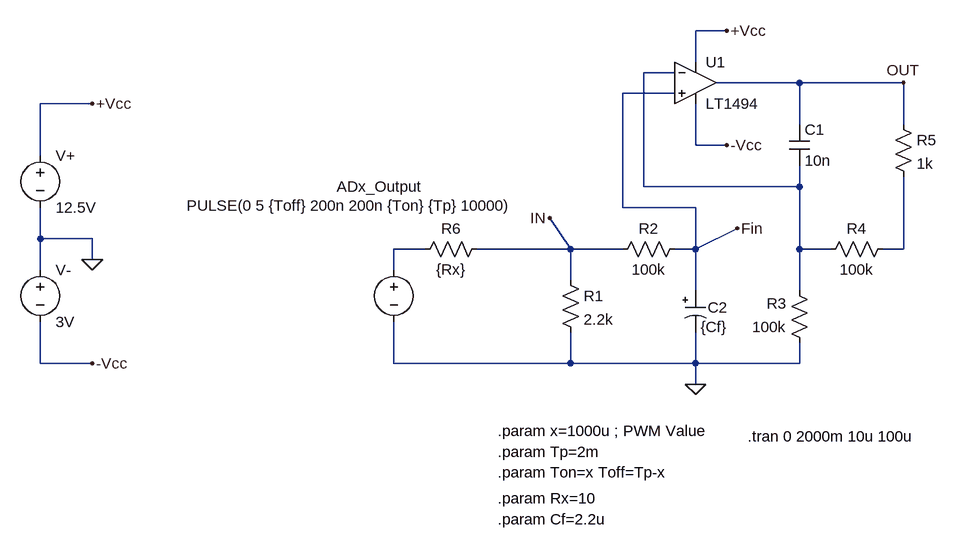
[diagram p0: schematic DAC_SIM10.asc]
DAC_SIM10.asc, the LTspice schematic file:
Version 4
SHEET 1 1124 680
WIRE 720 -304 672 -304
WIRE 672 -256 672 -304
WIRE 640 -240 592 -240
WIRE 832 -224 704 -224
WIRE 992 -224 832 -224
WIRE 640 -208 560 -208
WIRE -256 -192 -336 -192
WIRE 832 -160 832 -224
WIRE 992 -160 992 -224
WIRE 672 -128 672 -192
WIRE 720 -128 672 -128
WIRE -336 -112 -336 -192
WIRE 592 -64 592 -240
WIRE 832 -64 832 -96
WIRE 832 -64 592 -64
WIRE 560 -32 560 -208
WIRE 672 -32 560 -32
WIRE -336 16 -336 -32
WIRE -256 16 -336 16
WIRE 256 32 208 32
WIRE 480 32 448 -16
WIRE 480 32 336 32
WIRE 560 32 480 32
WIRE 672 32 672 -32
WIRE 672 32 736 0
WIRE 672 32 640 32
WIRE 832 32 832 -64
WIRE 880 32 832 32
WIRE 992 32 992 -80
WIRE 992 32 960 32
WIRE -256 48 -256 16
WIRE -336 64 -336 16
WIRE 208 64 208 32
WIRE 480 80 480 32
WIRE 672 96 672 32
WIRE 832 96 832 32
WIRE -336 208 -336 144
WIRE -256 208 -336 208
WIRE 208 208 208 144
WIRE 480 208 480 160
WIRE 480 208 208 208
WIRE 672 208 672 160
WIRE 672 208 480 208
WIRE 832 208 832 176
WIRE 832 208 672 208
WIRE 672 240 672 208
FLAG 448 -16 IN
FLAG 672 240 0
FLAG -256 208 -Vcc
FLAG -256 -192 +Vcc
FLAG 720 -304 +Vcc
FLAG 720 -128 -Vcc
FLAG -256 48 0
FLAG 992 -224 OUT
FLAG 736 0 Fin
SYMBOL voltage 208 48 R0
WINDOW 3 -319 -83 Left 2
WINDOW 123 0 0 Left 0
WINDOW 39 0 0 Left 0
WINDOW 0 -88 -112 Left 2
SYMATTR Value PULSE(0 5 {Toff} 200n 200n {Ton} {Tp} 10000)
SYMATTR InstName ADx_Output
SYMBOL res 464 64 R0
SYMATTR InstName R1
SYMATTR Value 2.2k
SYMBOL res 544 48 R270
WINDOW 0 32 56 VTop 2
WINDOW 3 0 56 VBottom 2
SYMATTR InstName R2
SYMATTR Value 100k
SYMBOL res 848 192 R180
WINDOW 0 36 76 Left 2
WINDOW 3 36 40 Left 2
SYMATTR InstName R3
SYMATTR Value 100k
SYMBOL res 976 16 R90
WINDOW 0 0 56 VBottom 2
WINDOW 3 32 56 VTop 2
SYMATTR InstName R4
SYMATTR Value 100k
SYMBOL res 976 -176 R0
SYMATTR InstName R5
SYMATTR Value 1k
SYMBOL OpAmps\\LT1494 672 -224 R0
SYMATTR InstName U1
SYMBOL polcap 656 96 R0
WINDOW 0 35 26 Left 2
SYMATTR InstName C2
SYMATTR Value {Cf}
SYMBOL voltage -336 48 R0
WINDOW 123 0 0 Left 0
WINDOW 39 0 0 Left 0
SYMATTR InstName V-
SYMATTR Value 3V
SYMBOL res 352 16 R90
WINDOW 0 0 56 VBottom 2
WINDOW 3 32 56 VTop 2
SYMATTR InstName R6
SYMATTR Value {Rx}
SYMBOL voltage -336 -128 R0
WINDOW 123 0 0 Left 0
WINDOW 39 0 0 Left 0
SYMATTR InstName V+
SYMATTR Value 12.5V
SYMBOL cap 816 -160 R0
SYMATTR InstName C1
SYMATTR Value 10n
TEXT 368 312 Left 2 !.param x=1000u ; PWM Value
TEXT 752 320 Left 2 !.tran 0 2000m 10u 100u
TEXT 368 376 Left 2 !.param Ton=x Toff=Tp-x
TEXT 368 344 Left 2 !.param Tp=2m
TEXT 368 416 Left 2 !.param Rx=10
TEXT 368 448 Left 2 !.param Cf=2.2u

The netlist it stands for:
* DAC_SIM10.asc
V§ADx_Output N002 0 PULSE(0 5 {Toff} 200n 200n {Ton} {Tp} 10000)
R1 IN 0 2.2k
R2 IN Fin 100k
R3 0 N001 100k
R4 N003 N001 100k
R5 OUT N003 1k
* U1: LT1494 (symbol OpAmps\LT1494 not available, pins judged from their places): In+=Fin In-=N001 V+=+Vcc V-=-Vcc OUT=OUT
C2 Fin 0 {Cf}
V- 0 -Vcc 3V
R6 IN N002 {Rx}
V+ +Vcc 0 12.5V
C1 OUT N001 10n
.param x=1000u ; PWM Value
.tran 0 2000m 10u 100u
.param Ton=x Toff=Tp-x
.param Tp=2m
.param Rx=10
.param Cf=2.2u
.backanno
.end